# Altium project PCB3_footprint_Project.PrjPcb
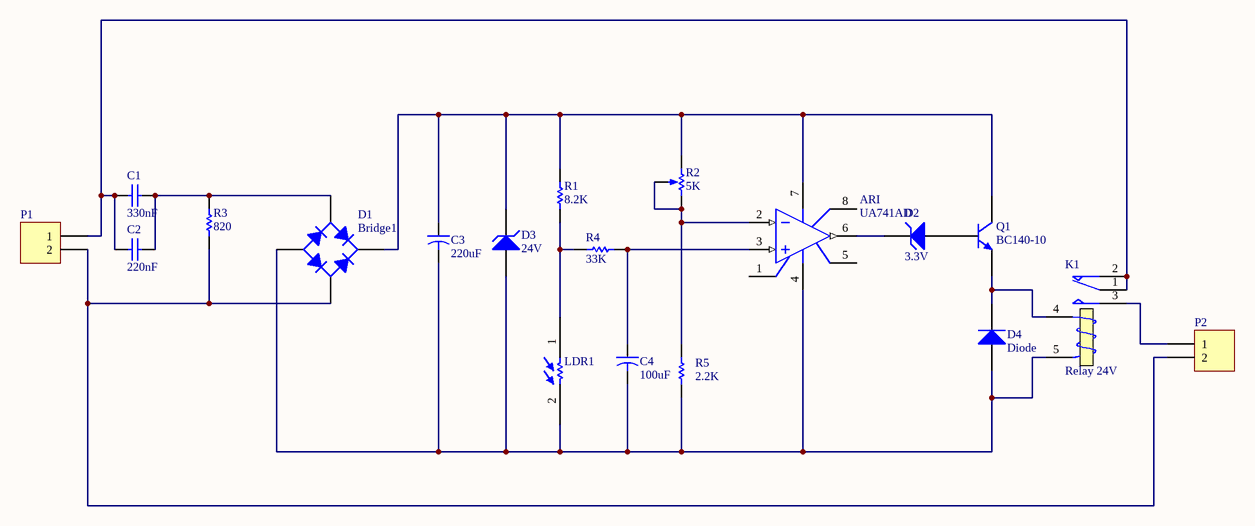
[diagram p0: Sheet2.SchDoc]
1 sheet, 19 parts. Net scope: global (net labels, ports and power ports of the same name join across sheets).
Board file: PCB2.PcbDoc

## Sheet Sheet2.SchDoc
size A

### Parts
ARI  UA741AD  [UA741cp]
C1  330nF  [220nfcap_330nfcap]
C2  220nF  [220nfcap_330nfcap]
C3  220uF  [cap220uf_electerolytic]
C4  100uF  [CAP100uF_ELECTROLYTIC]
D1  Bridge1  [diode_bridge]
D2  3.3V  [zener_diode]
D3  24V  [zener_diode]
D4  Diode  [diode]
K1  Relay 24V  [Relay]
LDR1  (no value)  [LDR]
P1  Header 2  [Connector]  (value not drawn)
P2  Header 2  [Connector]  (value not drawn)
Q1  BC140-10  [Bipolar_Transistors]
R1  8.2K  [Res_filmcarbon]
R2  5K  [potentiometer]
R3  820  [Res_filmcarbon]
R4  33K  [Res_filmcarbon]
R5  2.2K  [Res_filmcarbon]

### Nets
NetARI_2: ARI.2(IN-) R2.2(BOT) R2.3(TAP) R5.2
NetARI_3: ARI.3(IN+) C4.1 R4.2
NetARI_4: ARI.4(V-) C3.2 C4.2 D1.3(A) D3.1(A) D4.1(A) K1.5(T2) LDR1.2 R5.1
NetARI_6: ARI.6(OUT) D2.2(K)
NetARI_7: ARI.7(V+) C3.1 D1.1(K) D3.2(K) Q1.3(C) R1.2 R2.1(TOP)
NetC1_1: C1.1 C2.1 K1.1(COM) K1.2(NC) P1.1
NetC1_2: C1.2 C2.2 D1.4(C) R3.2
NetD1_2: D1.2(C) P1.2 P2.2 R3.1
NetD2_1: D2.1(A) Q1.2(B)
NetD4_2: D4.2(K) K1.4(T1) Q1.1(E)
NetK1_3: K1.3(NO) P2.1
NetLDR1_1: LDR1.1 R1.1 R4.1

Not connected (* = marked no-connect by the designer): ARI 1(OS_NULL) 5(OS_NULL) 8(NC)

### Library data of the parts
ARI = UA741AD: General-Purpose Single Operational Amplifier; Published: 24-Aug-2001; LatestRevisionDate: 13-Apr-2006; LatestRevisionNote: IPC-7351 Footprint Added.; DatasheetVersion: Oct-1997; PackageVersion: Dec-2002; PackageReference: SO8; Publisher: Altium Limited; PackageDescription: 8-Pin Small Outline Integrated Circuit 1.27 mm Pitch; Code_JEDEC: MS-012-AA; Code_IPC: SOIC127P600-8; ComponentLink1Description: Manufacturer Link; ComponentLink1URL: http://www.st.com/; ComponentLink2Description: Datasheet; ComponentLink2URL: http://www.st.com/stonline/products/literature/ds/5304/ua741.pdf
C1 C2 = Cap: Capacitor; Published: 8-Jun-2000; LatestRevisionDate: 17-Jul-2002; LatestRevisionNote: Re-released for DXP Platform.; PackageReference: RAD-0.3; Publisher: Altium Limited; PackageDescription: Radial Cap, Thru-Hole; 2 Leads; 0.3 in Pin Spacing
  C1: Value: 330nF
  C2: Value: 220nF
C3 = Cap2: Capacitor; Value: 330uF; Published: 23-Sep-2002; PackageReference: CAPR5-4X5; Publisher: Altium Limited; PackageDescription: Capacitor; 2 Leads
C4 = Cap2: Capacitor; Published: 23-Sep-2002; PackageReference: CAPR5-4X5; Publisher: Altium Limited; PackageDescription: Capacitor; 2 Leads; Value: 100uF
D1 = Bridge1: Full Wave Diode Bridge; Published: 8-Jun-2000; LatestRevisionDate: 29-May-2009; LatestRevisionNote: Sch pins A & K swapped.; DatasheetVersion: E2732B; PackageReference: D-38; Publisher: Altium Limited; PackageDescription: Bridge Rectifier; 4 Terminals; Body 9.4 x 9.4 mm (typ); Pitch 5.08 mm
D2 D3 = D Zener: Zener Diode; Published: 8-Jun-2000; LatestRevisionDate: 17-Jul-2002; LatestRevisionNote: Re-released for DXP Platform.; PackageReference: DIODE-0.7; Publisher: Altium Limited; PackageDescription: Diode, Thru-Hole; 2 Leads; 0.7 in Pin Spacing
  D2: Value: 3.3V
  D3: Value: 24V
D4 = Diode: Default Diode; Published: 8-Jun-2000; LatestRevisionDate: 17-Jul-2002; LatestRevisionNote: Re-released for DXP Platform.; PackageVersion: Sep-1996; PackageReference: SMC; Publisher: Altium Limited; PackageDescription: DO-214-AB/SMC; 2 C-Bend Leads; Body 7.9 x 5.9 mm, inc. leads (LxW); Code_JEDEC: DO-214-AB
K1 = Relay: SPDT Relay; Published: 8-Jun-2000; LatestRevisionDate: 17-Jul-2002; LatestRevisionNote: Re-released for DXP Platform.; PackageReference: MODULE5B; Publisher: Altium Limited
LDR1 = LDR
P1 P2 = Header 2: Header, 2-Pin; LatestRevisionDate: 17-Jul-2002; LatestRevisionNote: Re-released for DXP Platform.; Publisher: Altium Limited
Q1 = BC140-10: Amplifier Transistor NPN Silicon; Published: 29-Sep-2000; LatestRevisionDate: 17-Jul-2002; LatestRevisionNote: Re-released for DXP Platform.; DatasheetVersion: 1991; PackageVersion: 1997; PackageReference: 79-04; Publisher: Altium Limited; PackageDescription: Can; 3 Leads; Pin Circle Dia. 5.08 mm; Lead Dia. 0.48 mm (max); ComponentLink1Description: Manufacturer Link; ComponentLink1URL: http://www.onsemi.com/site/products/landing?taxonomyID=194
R1 R3-R5 = Res1: Resistor; Published: 8-Jun-2000; LatestRevisionDate: 17-Jul-2002; LatestRevisionNote: Re-released for DXP Platform.; PackageReference: AXIAL-0.3; Publisher: Altium Limited; PackageDescription: Axial Device, Thru-Hole; 2 Leads; 0.3 in Pin Spacing
  R1: Value: 8.2K
  R3: Value: 820
  R4: Value: 33K
  R5: Value: 2.2K
R2 = RPot: Potentiometer; Sim Note: Enter the Resistance value and the set point into parameter fields.; Set Position: 0.5; Published: 8-Jun-2000; LatestRevisionDate: 17-Jul-2002; LatestRevisionNote: Re-released for DXP Platform.; PackageReference: VR5; Publisher: Altium Limited; PackageDescription: Variable Resistor, Thru-Hole; 3 Leads; Value: 5K